# Altium project AlarmTiming.PrjPcb
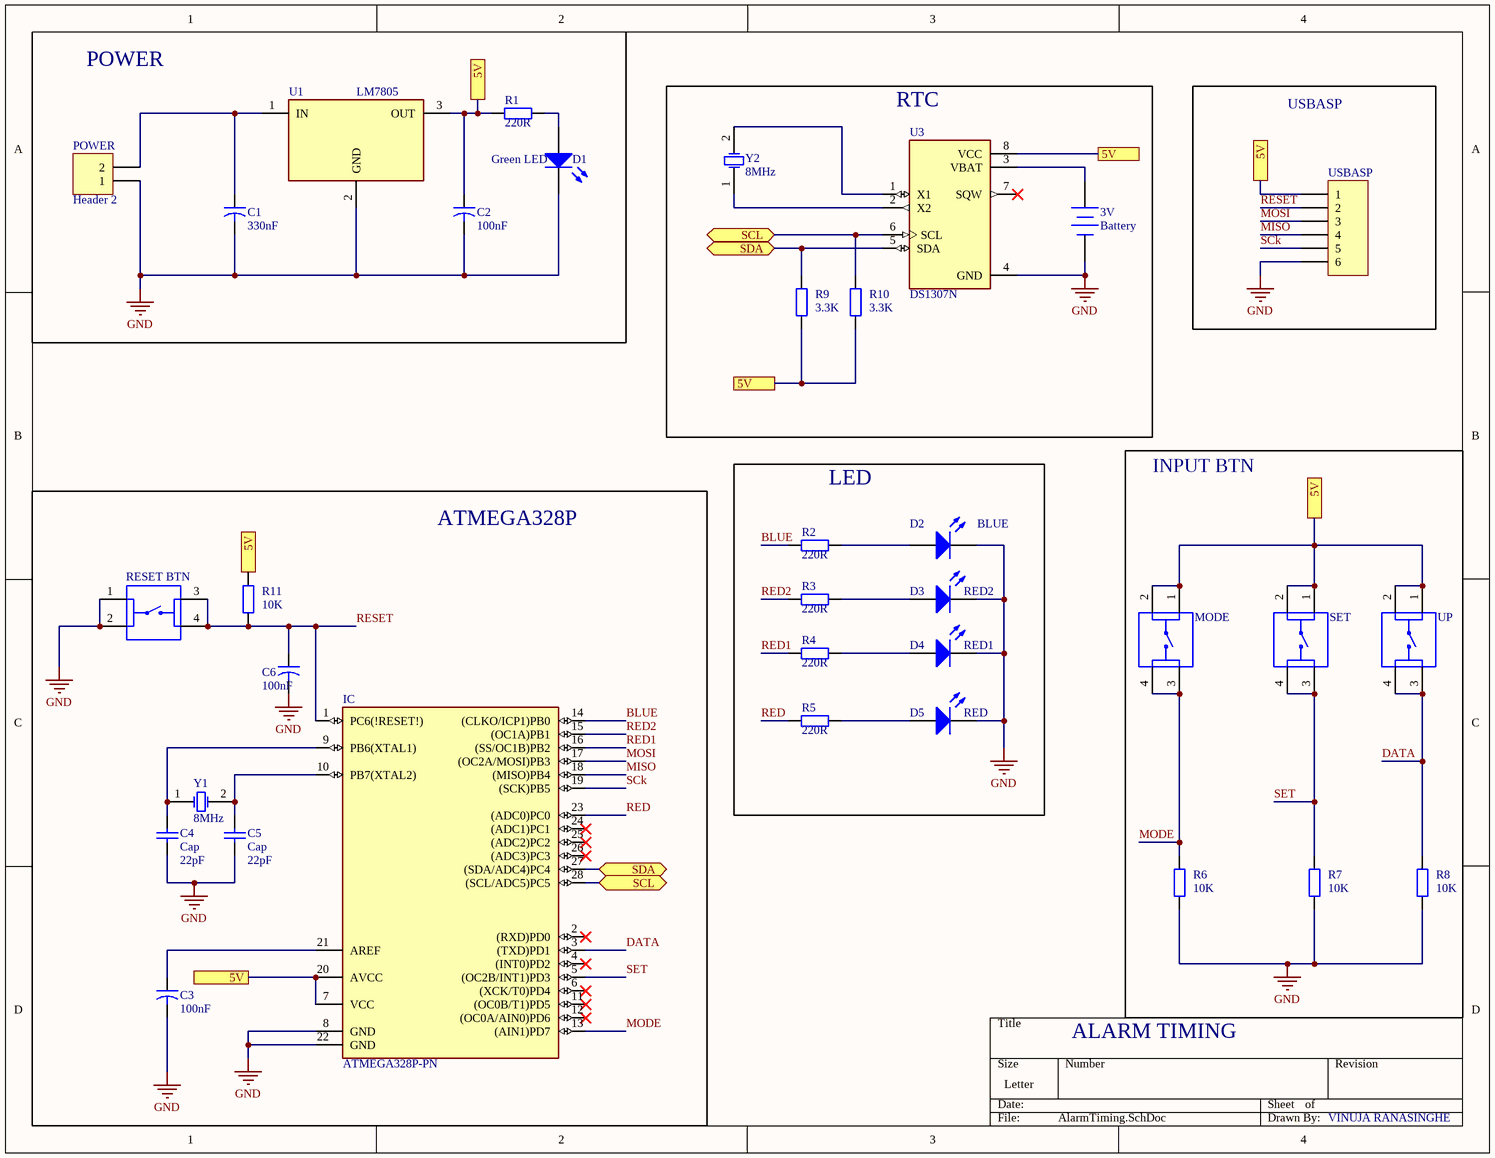
[diagram p0: AlarmTiming.SchDoc]
1 sheet, 34 parts. Net scope: flat (ports and power ports of the same name join across sheets).
Board file: AlarmTiming.PcbDoc

## Sheet AlarmTiming.SchDoc: Alarm Timing
size Letter; Rule: UNIONINDEX=0|RULEKIND=Clearance|NETSCOPE=DifferentNets|LAYERKIND=SameLayer|NAME=Schematic Clearance Constraint|GAP=10mil|GENERICCLEARANCE=10mil|IGNOREPADTOPADCLEARANCEINFOOTPRINT=FALSE|OBJECTCLEARANCES=ClearanceObj_Arc-ClearanceObj_Hole:0;ClearanceObj_Track-ClearanceObj_Hole:0;ClearanceObj_SMDPad-ClearanceObj_Hole:0;ClearanceObj_THPad-ClearanceObj_Hole:0;ClearanceObj_Via-ClearanceObj_Hole:0;ClearanceObj_Fill-ClearanceObj_Hole:0;ClearanceObj_Poly-ClearanceObj_Hole:0;ClearanceObj_Region-ClearanceObj_Hole:0;ClearanceObj_Text-ClearanceObj_Hole:0|UNIT=Imperial

### Parts
3V  Battery  [BAT-2]
C1  value 330nF  [CAPR5-4X5]  (hidden comment: Cap2)
C2  value 100nF  [CAPR5-4X5]  (hidden comment: Cap2)
C3  value 100nF  [CAPR5-4X5]  (hidden comment: Cap2)
C4  Cap  value 22pF  [RAD-0.3]
C5  Cap  value 22pF  [RAD-0.3]
C6  value 100nF  [CAPR5-4X5]  (hidden comment: Cap2)
D1  Green LED  [3.2X1.6X1.1]
D2  BLUE  [3.5X2.8X1.9]
D3  RED2  [LED-1]
D4  RED1  [LED-1]
D5  RED  [LED-1]
IC  ATMEGA328P-PN  [DIL28]
MODE  1825910-2  [TE_1825910-2]  (value not drawn)
POWER  Header 2  [HDR1X2]
R1  value 220R  [AXIAL-0.4]  (hidden comment: Res2)
R2  value 220R  [AXIAL-0.4]  (hidden comment: Res2)
R3  value 220R  [AXIAL-0.4]  (hidden comment: Res2)
R4  value 220R  [AXIAL-0.4]  (hidden comment: Res2)
R5  value 220R  [AXIAL-0.4]  (hidden comment: Res2)
R6  value 10K  [AXIAL-0.4]  (hidden comment: Res2)
R7  value 10K  [AXIAL-0.4]
R8  value 10K  [AXIAL-0.4]  (hidden comment: Res2)
R9  value 3.3K  [AXIAL-0.4]  (hidden comment: Res2)
R10  value 3.3K  [AXIAL-0.4]  (hidden comment: Res2)
R11  value 10K  [AXIAL-0.4]  (hidden comment: Res2)
RESET_BTN  1825910-2  [TE_1825910-2]  (value not drawn)
SET  1825910-2  [TE_1825910-2]  (value not drawn)
U1  LM7805  [TO220]
U3  DS1307N  [DIP762W47P254L991H457Q8]
UP  1825910-2  [TE_1825910-2]  (value not drawn)
USBASP  Header 6  [HDR1X6]  (value not drawn)
Y1  8MHz  [R38]
Y2  8MHz  [R38]

### Blocks framed on the sheet
RTC: 3V R9 R10 U3 Y2
USBASP: USBASP
LED: D2-D5 R2-R5
INPUT BTN: MODE R6-R8 SET UP
ATMEGA328P: C3-C6 IC R11 RESET_BTN Y1

### Ports
5V, SCL (bidir), SDA (bidir)

### Nets
GND: 3V.2(-) C1.2 C2.2 C3.2 C4.1 C5.1 C6.2 D1.2(K) D2.2(K) D3.2(K) D4.2(K) D5.2(K) IC.8(GND) IC.22(GND) POWER.1 R6.1 R7.1 R8.1 RESET_BTN.1 RESET_BTN.2 U1.2(GND) U3.4(GND) USBASP.6
BLUE: IC.14((CLKO/ICP1)PB0) R2.1
DATA: IC.3((TXD)PD1) R8.2 UP.3 UP.4
MISO: IC.18((MISO)PB4) USBASP.4
MODE: IC.13((AIN1)PD7) MODE.3 MODE.4 R6.2
MOSI: IC.17((OC2A/MOSI)PB3) USBASP.3
RED: IC.23((ADC0)PC0) R5.1
RED1: IC.16((SS/OC1B)PB2) R4.1
RED2: IC.15((OC1A)PB1) R3.1
RESET: C6.1 IC.1(PC6(!RESET!)) R11.1 RESET_BTN.3 RESET_BTN.4 USBASP.2
SCk: IC.19((SCK)PB5) USBASP.5
SET: IC.5((OC2B/INT1)PD3) R7.2 SET.3 SET.4
Net3V_1: 3V.1(+) U3.3(VBAT)
NetC1_1: C1.1 POWER.2 U1.1(IN)
NetC2_1: C2.1 IC.7(VCC) IC.20(AVCC) MODE.1 MODE.2 R1.1 R9.1 R10.1 R11.2 SET.1 SET.2 U1.3(OUT) U3.8(VCC) UP.1 UP.2 USBASP.1 ; port 5V
NetC3_1: C3.1 IC.21(AREF)
NetC4_2: C4.2 IC.9(PB6(XTAL1)) Y1.1(OSC1)
NetC5_2: C5.2 IC.10(PB7(XTAL2)) Y1.2(OSC2)
NetD1_1: D1.1(A) R1.2
NetD2_1: D2.1(A) R2.2
NetD3_1: D3.1(A) R3.2
NetD4_1: D4.1(A) R4.2
NetD5_1: D5.1(A) R5.2
NetIC_27: IC.27((SDA/ADC4)PC4) R9.2 U3.5(SDA) ; port SDA
NetIC_28: IC.28((SCL/ADC5)PC5) R10.2 U3.6(SCL) ; port SCL
NetU3_1: U3.1(X1) Y2.2(OSC2)
NetU3_2: U3.2(X2) Y2.1(OSC1)

Not connected (* = marked no-connect by the designer): IC 2((RXD)PD0)* 4((INT0)PD2)* 6((XCK/T0)PD4)* 11((OC0B/T1)PD5)* 12((OC0A/AIN0)PD6)* 24((ADC1)PC1)* 25((ADC2)PC2)* 26((ADC3)PC3)*; U3 7(SQW)*

### Notes on the sheet
- POWER
- ALARM TIMING
- VINUJA RANASINGHE

### Library data of the parts
3V = Battery: Multicell Battery; Published: 24-Mar-1999; LatestRevisionDate: 17-Jul-2002; LatestRevisionNote: Re-released for DXP Platform.; PackageReference: BAT-2; Publisher: Altium Limited; PackageDescription: Battery; 2 Leads
C1-C3 C6 = Cap2: Capacitor; Published: 23-Sep-2002; PackageReference: CAPR5-4X5; Publisher: Altium Limited; PackageDescription: Capacitor; 2 Leads
C4 C5 = Cap: Capacitor; Published: 8-Jun-2000; LatestRevisionDate: 17-Jul-2002; LatestRevisionNote: Re-released for DXP Platform.; PackageReference: RAD-0.3; Publisher: Altium Limited; PackageDescription: Radial Cap, Thru-Hole; 2 Leads; 0.3 in Pin Spacing
D1 = LED2: Typical RED, GREEN, YELLOW, AMBER GaAs LED; Published: 8-Jun-2000; LatestRevisionDate: 17-Jul-2002; LatestRevisionNote: Re-released for DXP Platform.; PackageVersion: Feb-2002; PackageReference: 3.2X1.6X1.1; Publisher: Altium Limited; PackageDescription: SM LED; 2 Flat Leads
D2 = LED3: Typical BLUE SiC LED; Published: 8-Jun-2000; LatestRevisionDate: 17-Dec-2003; LatestRevisionNote: PCB Footprint replaced.; DatasheetVersion: 16-Apr-2002; PackageVersion: 16-Apr-2002; PackageReference: 3.5X2.8X1.9; Publisher: Altium Limited; PackageDescription: SM LED; 2 C-Bend Leads; Body 3.5 x 2.8 x 1.9 mm, inc leads (LxWxH typ)
D3-D5 = LED1: Typical RED GaAs LED; Published: 8-Jun-2000; LatestRevisionDate: 08-Jul-2005; LatestRevisionNote: Mech Layer 1 removed.; PackageReference: LED-1; Publisher: Altium Limited; PackageDescription: LED; 2 Leads
IC = ATMEGA328P-PN: AVR AVRÂ® ATmega Microcontroller IC 8-Bit 20MHz 32KB _16K x 16_ FLASH 28-PDIP; MF: Microchip; Availability: Unavailable; SnapEDA_Link: https://www.snapeda.com/parts/ATMEGA328P-PN/Microchip/view-part/396640/?ref=snap; Price: None; Package: PDIP-28 Atmel; MP: ATMEGA328P-PN; Value: *
MODE RESET_BTN SET UP = 1825910-2: 50 mA SPST Round Actuator 160 Gram Force Tactile Pushbutton Switch; Contact_Current_Rating: 50 mA; MF: TE Connectivity; Configuration_Pole-Throw: Single Pole - Single Throw; Availability: Unavailable; MP: 1825910-2; Value: *; Package: None; SnapEDA_Link: https://www.snapeda.com/parts/1825910-2/TE%20Connectivity%20ALCOSWITCH%20Switches/view-part/278983/?ref=snap; TE_purchase_URL: https://www.te.com/usa-en/product-1825910-2.html?te_bu=Cor&te_type=disp&te_campaign=seda_glo_cor-seda-global-disp-prtnr-fy19-seda-model-bom-cta_sma-317_1&elqCampaignId=32493; EU_RoHS_Compliance: Compliant; Price: None
POWER = Header 2: Header, 2-Pin; LatestRevisionDate: 17-Jul-2002; LatestRevisionNote: Re-released for DXP Platform.; Publisher: Altium Limited
R1-R11 = Res2: Resistor; Published: 8-Jun-2000; LatestRevisionDate: 17-Jul-2002; LatestRevisionNote: Re-released for DXP Platform.; PackageReference: AXIAL-0.4; Publisher: Altium Limited; PackageDescription: Axial Device, Thru-Hole; 2 Leads; 0.4 in Pin Spacing
U1 = LM7805: Linear Voltage Regulator IC 1 Output 1.5A SOT-223-4; MF: Texas Instruments; Availability: Unavailable; SnapEDA_Link: https://www.snapeda.com/parts/LM7805/Texas%20Instruments/view-part/2302466/?ref=snap; MP: LM7805; Price: None; Value: *; Package: TO-220 Texas Instruments
U3 = DS1307N: Real Time Clock _RTC_ IC Clock/Calendar 56B IÂ²C, 2-Wire Serial 8-DIP _0.300, 7.62mm_; MF: Maxim Integrated; Availability: Unavailable; SnapEDA_Link: https://www.snapeda.com/parts/DS1307N/Maxim%20Integrated/view-part/9754/?ref=snap; MP: DS1307N; Value: *; Price: None; Package: DIP-8 Maxim Integrated
USBASP = Header 6: Header, 6-Pin; LatestRevisionDate: 17-Jul-2002; LatestRevisionNote: Re-released for DXP Platform.; Publisher: Altium Limited
Y1 Y2 = XTAL: Crystal Oscillator; Published: 8-Jun-2000; LatestRevisionDate: 17-Jul-2002; LatestRevisionNote: Re-released for DXP Platform.; PackageReference: R38; Publisher: Altium Limited; PackageDescription: Crystal, Thru-Hole; 2 Leads; Body 3.1 x 8.2 mm (Dia.xH)